# Altium schematic sheet POWR0009.SchDoc: Title Block Template
size A3; Engineer: C. BROWN; Organization: BLUEsat Project; Address1: Room 419; Address2: School of EE&T; Address3: UNSW, NSW 2052; Address4: Australia; DocumentNumber: TITL0002; SheetNumber: 1; SheetTotal: 1; Description: Sample Title Block; Version: 2.0
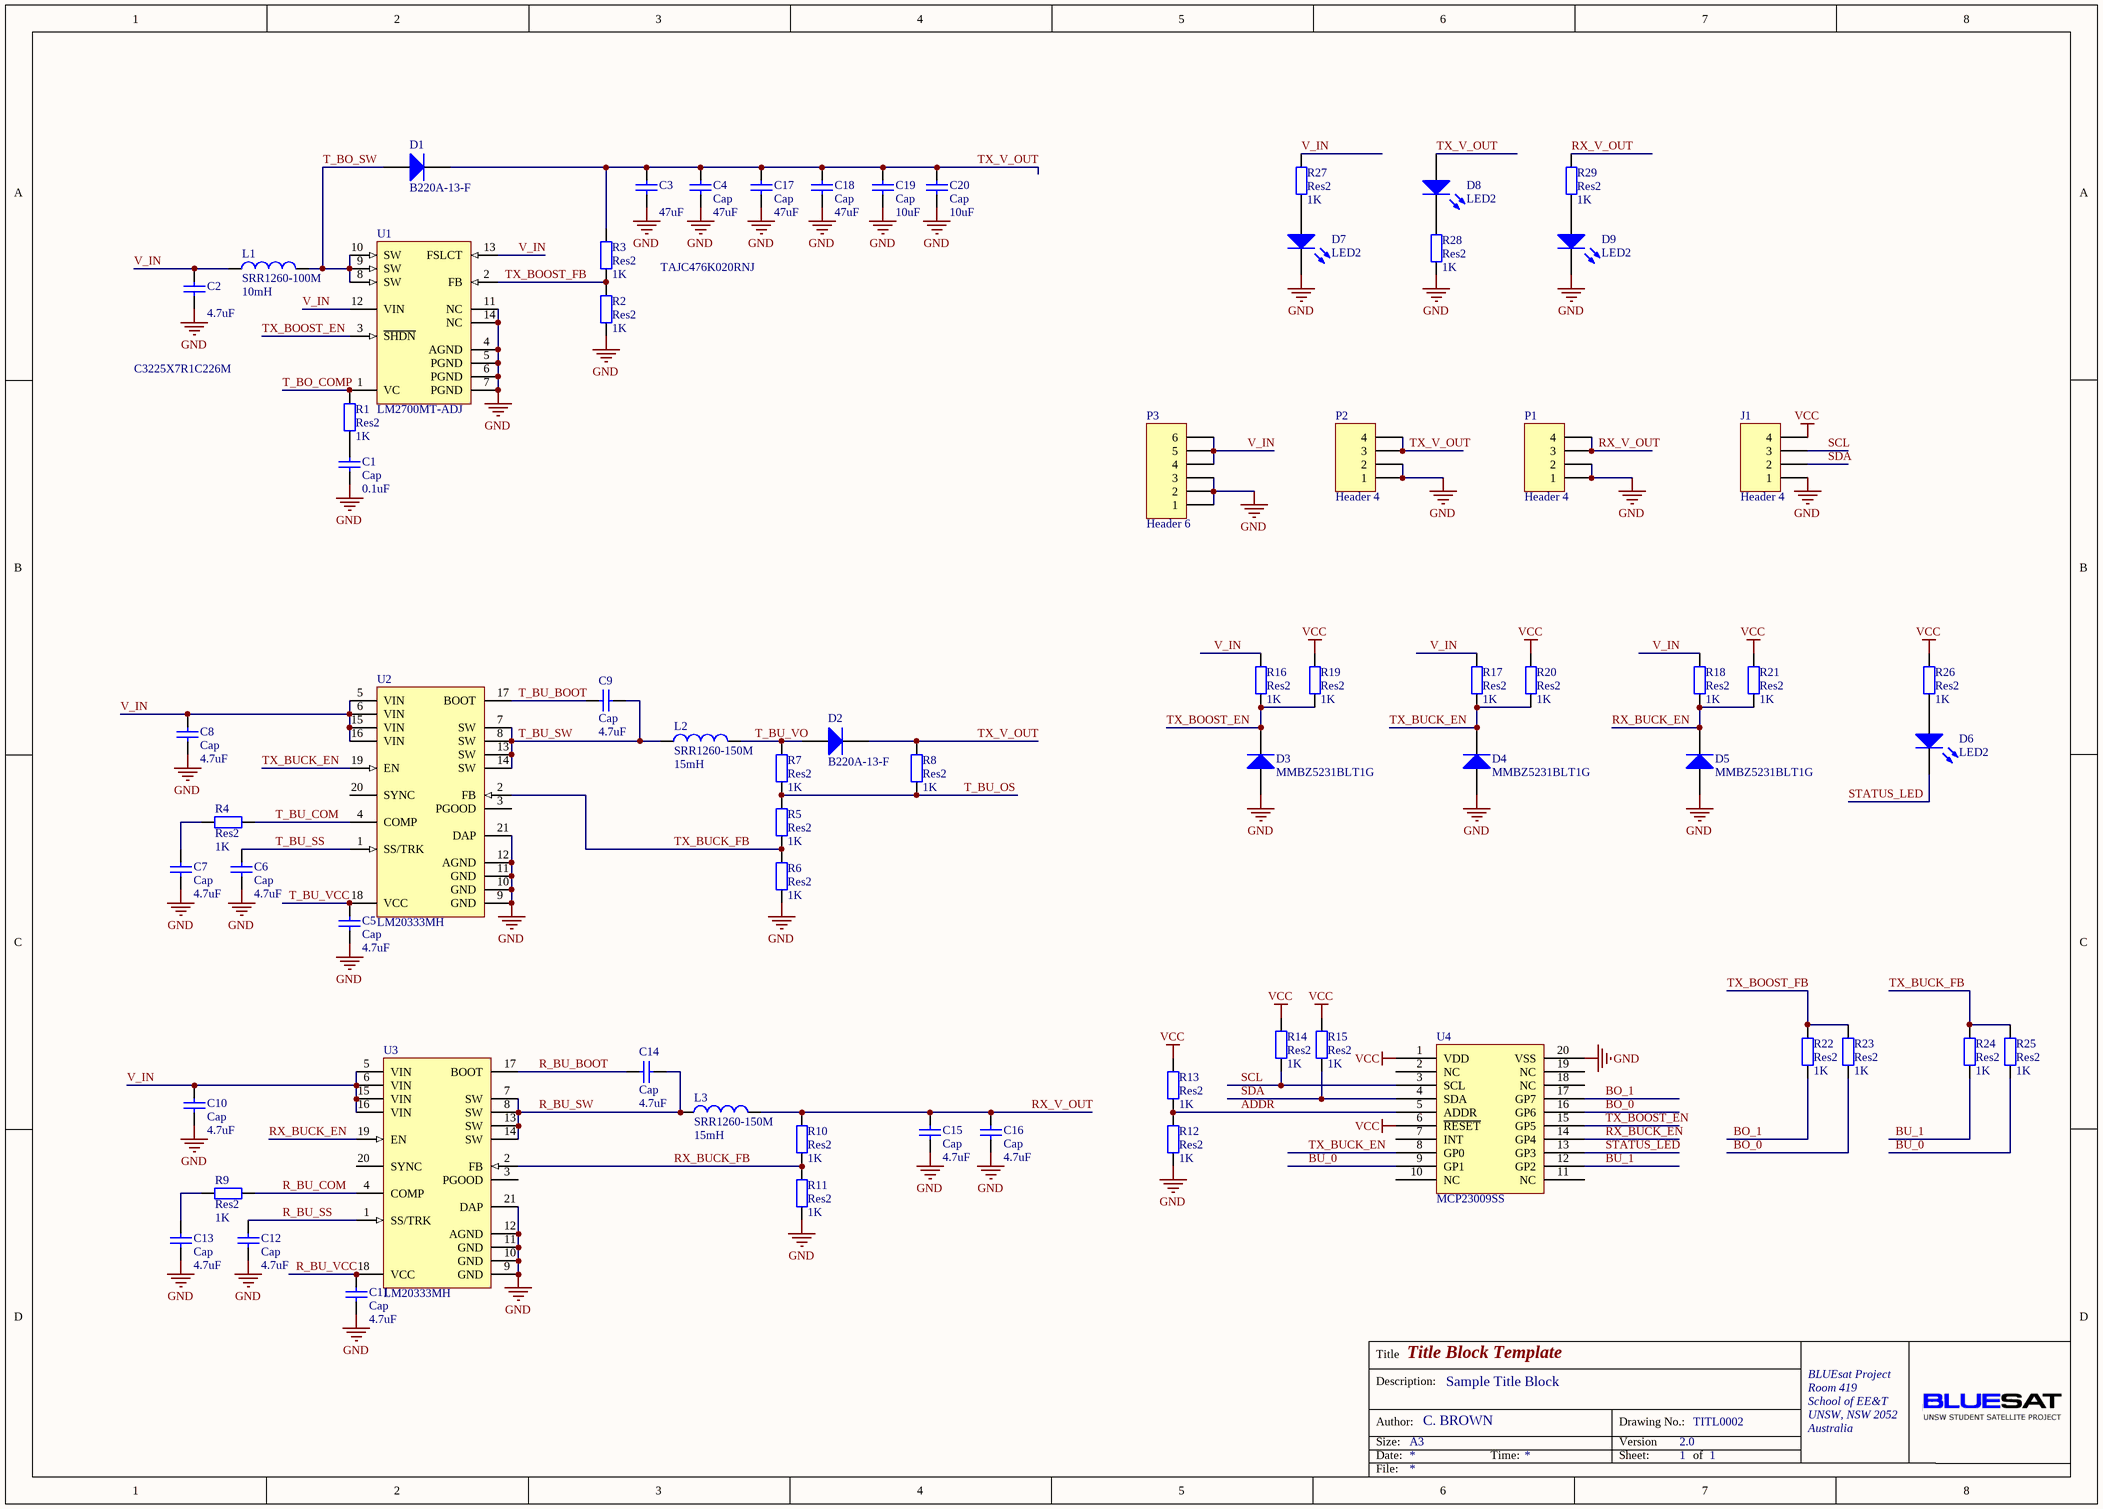
[diagram p0: POWR0009.SchDoc]

## Parts
C1  Cap  value 0.1uF  [R0805M]
C2  C3225X7R1C226M  value 4.7uF  [R1210M]
C3  TAJC476K020RNJ  value 47uF  [TANTCASEC]
C4  Cap  value 47uF  [TANTCASEC]
C5  Cap  value 4.7uF  [R0805M]
C6  Cap  value 4.7uF  [R0805M]
C7  Cap  value 4.7uF  [R0805M]
C8  Cap  value 4.7uF  [R1210M]
C9  Cap  value 4.7uF  [R0805M]
C10  Cap  value 4.7uF  [R1210M]
C11  Cap  value 4.7uF  [R0805M]
C12  Cap  value 4.7uF  [R0805M]
C13  Cap  value 4.7uF  [R0805M]
C14  Cap  value 4.7uF  [R0805M]
C15  Cap  value 4.7uF  [R0805M]
C16  Cap  value 4.7uF  [R0805M]
C17  Cap  value 47uF  [TANTCASEC]
C18  Cap  value 47uF  [TANTCASEC]
C19  Cap  value 10uF  [R0805M]
C20  Cap  value 10uF  [R0805M]
D1  B220A-13-F  [DIODESMA]
D2  B220A-13-F  [DIODESMA]
D3  MMBZ5231BLT1G  [SOT95P240-3N]
D4  MMBZ5231BLT1G  [SOT95P240-3N]
D5  MMBZ5231BLT1G  [SOT95P240-3N]
D6  LED2  [R0805M]
D7  LED2  [R0805M]
D8  LED2  [R0805M]
D9  LED2  [R0805M]
J1  Header 4  [HDR1X4]
L1  SRR1260-100M  value 10mH  [SRR1260M]
L2  SRR1260-150M  value 15mH  [SRR1260M]
L3  SRR1260-150M  value 15mH  [SRR1260M]
P1  Header 4  [HDR1X4]
P2  Header 4  [HDR1X4]
P3  Header 6  [HDR1X6]
R1  Res2  value 1K  [R0805M]
R2  Res2  value 1K  [R0805M]
R3  Res2  value 1K  [R0805M]
R4  Res2  value 1K  [R0805M]
R5  Res2  value 1K  [R0805M]
R6  Res2  value 1K  [R0805M]
R7  Res2  value 1K  [R0805M]
R8  Res2  value 1K  [R0805M]
R9  Res2  value 1K  [R0805M]
R10  Res2  value 1K  [R0805M]
R11  Res2  value 1K  [R0805M]
R12  Res2  value 1K  [R0805M]
R13  Res2  value 1K  [R0805M]
R14  Res2  value 1K  [R0805M]
R15  Res2  value 1K  [R0805M]
R16  Res2  value 1K  [R0805M]
R17  Res2  value 1K  [R0805M]
R18  Res2  value 1K  [R0805M]
R19  Res2  value 1K  [R0805M]
R20  Res2  value 1K  [R0805M]
R21  Res2  value 1K  [R0805M]
R22  Res2  value 1K  [R0805M]
R23  Res2  value 1K  [R0805M]
R24  Res2  value 1K  [R0805M]
R25  Res2  value 1K  [R0805M]
R26  Res2  value 1K  [R0805M]
R27  Res2  value 1K  [R0805M]
R28  Res2  value 1K  [R0805M]
R29  Res2  value 1K  [R0805M]
U1  LM2700MT-ADJ  [MTC14_N]
U2  LM20333MH  [MXA20A_N]
U3  LM20333MH  [MXA20A_N]
U4  MCP23009SS  [SSOP-SS20_M]

## Nets
GND: C1.1 C2.1 C3.1 C4.1 C5.1 C6.1 C7.1 C8.1 C10.1 C11.1 C12.1 C13.1 C15.1 C16.1 C17.1 C18.1 C19.1 C20.1 D3.1(A) D4.1(A) D5.1(A) D7.2(K) D9.2(K) J1.1 P1.1 P1.2 P2.1 P2.2 P3.1 P3.2 P3.3 R2.1 R6.2 R11.1 R12.1 R28.1 U1.4(AGND) U1.5(PGND) U1.6(PGND) U1.7(PGND) U1.11(NC) U1.14(NC) U2.9(GND) U2.10(GND) U2.11(GND) U2.12(AGND) U2.21(DAP) U3.9(GND) U3.10(GND) U3.11(GND) U3.12(AGND) U3.21(DAP) U4.20(VSS)
VCC: J1.4 R13.2 R14.2 R15.2 R19.2 R20.2 R21.2 R26.2 U4.1(VDD) U4.6(~{RESET})
ADDR: R12.2 R13.1 U4.5(ADDR)
BO_0: R23.1 U4.16(GP6)
BO_1: R22.1 U4.17(GP7)
BU_0: R25.1 U4.9(GP1)
BU_1: R24.1 U4.12(GP2)
R_BU_BOOT: C14.1 U3.17(BOOT)
R_BU_COM: R9.1 U3.4(COMP)
R_BU_SS: C12.2 U3.1(SS/TRK)
R_BU_SW: C14.2 L3.1 U3.7(SW) U3.8(SW) U3.13(SW) U3.14(SW)
R_BU_VCC: C11.2 U3.18(VCC)
RX_BUCK_EN: D5.3(K) R18.1 R21.1 U3.19(EN) U4.14(GP4)
RX_BUCK_FB: R10.1 R11.2 U3.2(FB)
RX_V_OUT: C15.2 C16.2 L3.2 P1.3 P1.4 R10.2 R29.2
SCL: J1.3 R14.1 U4.3(SCL)
SDA: J1.2 R15.1 U4.4(SDA)
STATUS_LED: D6.2(K) U4.13(GP3)
T_BO_COMP: R1.2 U1.1(VC)
T_BO_SW: D1.1(A) L1.2 U1.8(SW) U1.9(SW) U1.10(SW)
T_BU_BOOT: C9.2 U2.17(BOOT)
T_BU_COM: R4.1 U2.4(COMP)
T_BU_OS: R5.1 R7.2 R8.2
T_BU_SS: C6.2 U2.1(SS/TRK)
T_BU_SW: C9.1 L2.1 U2.7(SW) U2.8(SW) U2.13(SW) U2.14(SW)
T_BU_VCC: C5.2 U2.18(VCC)
T_BU_VO: D2.1(A) L2.2 R7.1
TX_BOOST_EN: D3.3(K) R16.1 R19.1 U1.3(~{SHDN}) U4.15(GP5)
TX_BOOST_FB: R2.2 R3.1 R22.2 R23.2 U1.2(FB)
TX_BUCK_EN: D4.3(K) R17.1 R20.1 U2.19(EN) U4.8(GP0)
TX_BUCK_FB: R5.2 R6.1 R24.2 R25.2 U2.2(FB)
TX_V_OUT: C3.2 C4.2 C17.2 C18.2 C19.2 C20.2 D1.2(K) D2.2(K) D8.1(A) P2.3 P2.4 R3.2 R8.1
V_IN: C2.2 C8.2 C10.2 L1.1 P3.4 P3.5 P3.6 R16.2 R17.2 R18.2 R27.2 U1.12(VIN) U1.13(FSLCT) U2.5(VIN) U2.6(VIN) U2.15(VIN) U2.16(VIN) U3.5(VIN) U3.6(VIN) U3.15(VIN) U3.16(VIN)
NetC1_2: C1.2 R1.1
NetC7_2: C7.2 R4.2
NetC13_2: C13.2 R9.2
NetD6_1: D6.1(A) R26.1
NetD7_1: D7.1(A) R27.1
NetD8_2: D8.2(K) R28.2
NetD9_1: D9.1(A) R29.1

Not connected (* = marked no-connect by the designer): U2 3(PGOOD) 20(SYNC); U3 3(PGOOD) 20(SYNC); U4 2(NC) 7(INT) 10(NC) 11(NC) 18(NC) 19(NC)

## Notes on the sheet
- Title
- Description:
- Size:
- Author:
- Date:
- A3
- Time:
- Version
- Sheet:
- Drawing No.:
- of
- File:

## Library data of the parts
C1-C20 = Cap: Capacitor; Published: 8-Jun-2000; LatestRevisionDate: 17-Jul-2002; LatestRevisionNote: Re-released for DXP Platform.; PackageReference: RAD-0.3; Publisher: Altium Limited
D1 D2 = Diode 1N4148: High Conductance Fast Diode; Published: 8-Jun-2000; LatestRevisionDate: 17-Jul-2002; LatestRevisionNote: Re-released for DXP Platform.; DatasheetVersion: 1997; PackageReference: DO-35; Publisher: Altium Limited; Code_JEDEC: DO-204-AH; ComponentLink1Description: Manufacturer Link; ComponentLink1URL: http://www.fairchildsemi.com/; ComponentLink2Description: Datasheet; ComponentLink2URL: http://www.fairchildsemi.com/ds/1N%2F1N4148.pdf
D3-D5 = Diode BAS16: Silicon Switching Diode for High-Speed Switching; Note: Pin 2 is not connected and not drawn.; Published: 21-Mar-2003; LatestRevisionDate: 29-May-2009; LatestRevisionNote: IPC-7351 Footprint Added.; DatasheetVersion: Oct-1999; PackageVersion: Sep-2001; PackageReference: SOT-23; Publisher: Altium Limited; PackageDescription: 3-Pin SOT-23 Package 0.95 mm Pitch, 2.5 mm Lead Span; ComponentLink1Description: Manufacturer Link; ComponentLink1URL: http://www.infineon.com/; ComponentLink2Description: Datasheet; ComponentLink2URL: http://www.infineon.com/upload/Document/cmc_upload/documents/012/5331/bas16series.pdf
D6-D9 = LED2: Typical RED, GREEN, YELLOW, AMBER GaAs LED; Published: 8-Jun-2000; LatestRevisionDate: 17-Jul-2002; LatestRevisionNote: Re-released for DXP Platform.; PackageVersion: Feb-2002; PackageReference: 3.2X1.6X1.1; Publisher: Altium Limited
J1 P1 P2 = Header 4: Header, 4-Pin; LatestRevisionDate: 17-Jul-2002; LatestRevisionNote: Re-released for DXP Platform.; Publisher: Altium Limited
L1-L3 = Inductor: Code_IEC: 1005; Published: 8-Jun-2000; LatestRevisionDate: 29-May-2009; LatestRevisionNote: IPC-7351 Footprint Added.; PackageReference: 0402-A; Publisher: Altium Limited; PackageDescription: Chip Inductor; Code_JEITA: 0402
P3 = Header 6: Header, 6-Pin; LatestRevisionDate: 17-Jul-2002; LatestRevisionNote: Re-released for DXP Platform.; Publisher: Altium Limited
R1-R29 = Res2: Resistor; Published: 8-Jun-2000; LatestRevisionDate: 17-Jul-2002; LatestRevisionNote: Re-released for DXP Platform.; PackageReference: AXIAL-0.4; Publisher: Altium Limited
U1 = LM2700MT-ADJ: 600kHz/1.25MHz, 2.5A, Step-up PWM DC/DC Converter; Manufacturer: National Semiconductor; CompType: Switcher; PackageTopMarking: NSZXYTT*2700MT*-ADJ; PowerWise: N; Published: 4-Dec-2008; DatasheetVersion: May-2004; PackageVersion: revD, Jun-2003; PackageReference: MTC14; Publisher: Altium Limited; PackageDescription: Molded TSSOP, JEDEC, 5 x 4.4 x 0.9mm Body, 14 Lead, 0.65mm Pitch; PartNumber: LM2700MT-ADJ; RoHS: O; PinCount: 14; DigiKeyPartNumber: LM2700MT-ADJ-ND; Code_JEDEC: MO-153-AB-1; ComponentLink1Description: LM2700 Datasheet; ComponentLink1URL: http://www.national.com/ds/LM/LM2700.pdf; ComponentLink2Description: LM2700 Web Page; ComponentLink2URL: http://www.national.com/pf/LM/LM2700.html; ComponentLink3Description: MTC14 Package Drawing; ComponentLink3URL: http://www.national.com/packaging/folders/mtc14.html
U2 U3 = LM20333MH: 36V, 3A PowerWise Synchronous Buck Regulator with Frequency Synchronization; Manufacturer: National Semiconductor; CompType: Switcher; PackageTopMarking: NSUZXYTT*20333MH; Published: 4-Dec-2008; DatasheetVersion: Jun-2008; PackageVersion: revC, Jul-2006; PackageReference: MXA20A; Publisher: Altium Limited; PackageDescription: Molded TSSOP, Jedec, 6.5 x 4.4 x 0.9mm Body, 20 Lead, 0.65mm Pitch, Exposed Pad; PartNumber: LM20333MH; RoHS: Y; PinCount: 20; DigiKeyPartNumber: LM20333MH-ND; Code_JEDEC: MO-153-ACT; ComponentLink1Description: LM20333 Datasheet; ComponentLink1URL: http://www.national.com/ds/LM/LM20333.pdf; ComponentLink2Description: LM20333 Web Page; ComponentLink2URL: http://www.national.com/pf/LM/LM20333.html; ComponentLink3Description: MXA20A Package Drawing; ComponentLink3URL: http://www.national.com/packaging/folders/mxa20a.html